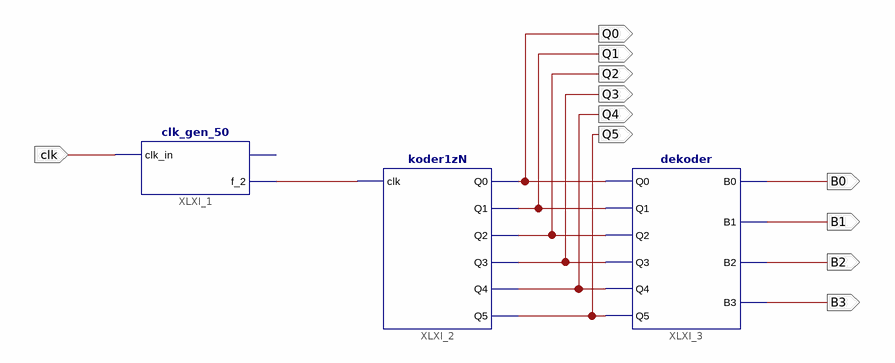
[diagram p0: schematic sheet 1]
// Xilinx ISE schematic symulacja.sch (spartan3e) as structural Verilog: 3 symbols, 11 ports
module symulacja (
  input  clk,
  output B0,
  output B1,
  output B2,
  output B3,
  output Q0,
  output Q1,
  output Q2,
  output Q3,
  output Q4,
  output Q5
);

  wire XLXN_1;

  clk_gen_50 XLXI_1 (.clk_in(clk), .f_2(XLXN_1));  // open: f_1
  koder1zN XLXI_2 (.clk(XLXN_1), .Q0(Q0), .Q1(Q1), .Q2(Q2), .Q3(Q3), .Q4(Q4), .Q5(Q5));
  dekoder XLXI_3 (.B0(B0), .B1(B1), .B2(B2), .B3(B3), .Q1(Q1), .Q5(Q5), .Q4(Q4), .Q2(Q2), .Q3(Q3), .Q0(Q0));

  // Notes on the sheet:
  //   LOC on signal B0 = M13
  //   LOC on signal B1 = R18
  //   LOC on signal B2 = R15
  //   LOC on signal B3 = T17
  //   LOC on signal clk = B8
  //   LOC on signal Q0 = L15
  //   LOC on signal Q1 = K12
  //   LOC on signal Q2 = L17
  //   LOC on signal Q3 = M15
  //   LOC on signal Q4 = K13
  //   LOC on signal Q5 = L16
endmodule
